# EAGLE design Grove - 3-axis analog accelerometer (EAGLE 6.1)
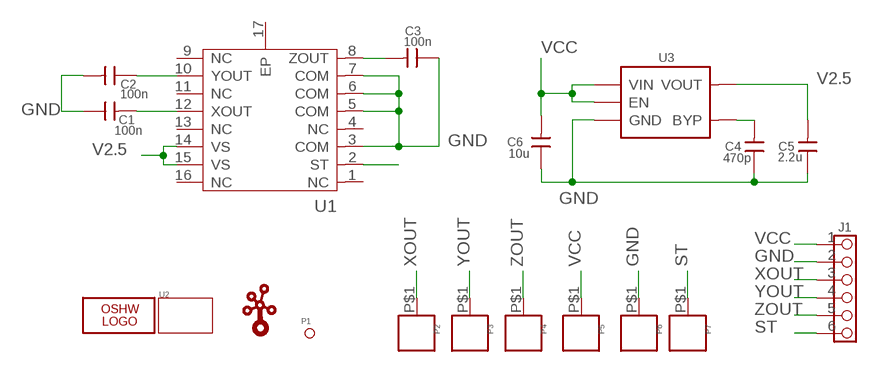
[diagram p0: schematic, sheet 1]

## Parts
C1  100n  C-0402  [0402]
C2  100n  C-0402  [0402]
C3  100n  C-0402  [0402]
C4  470p  C-0603  [0603]
C5  2.2u  C-0603  [0603]
C6  10u  C-0603  [0603]
J1  HEADER-6P-60/35MIL  [6P-2.54-60/35MIL]
LOGO2  LOGO-OSHW-6MILX0200-NT  [OSHW_6X200_NOTEXT]
P1  PAD-MARK  [ROUND-MARK-0.635]
P2  PAD'1X2MM'  [1P-1X2]
P3  PAD'1X2MM'  [1P-1X2]
P4  PAD'1X2MM'  [1P-1X2]
P5  PAD'1X2MM'  [1P-1X2]
P6  PAD'1X2MM'  [1P-1X2]
P7  PAD'1X2MM'  [1P-1X2]
U1  ADXL335  [LFCSP16-4X4]
U2  TWIG-1U  [1U-DIM-W/-DRILL]
U3  MIC5205  [SOT23-5]
U$1  LOGO-TWIGTWIGLOGO_SMALL  [TWIGLOGO_SMALL]

## Nets
GND: C1.1 C2.2 C3.1 C4.1 C5.1 C6.1 J1.2 P6.P$1 U1.3(COM) U1.5(COM) U1.6(COM) U1.7(COM) U3.2(GND)
N$7: C4.2 U3.4(BYP)
ST: J1.6 P7.P$1 U1.2(ST)
V2.5: C5.2 U1.14(VS) U1.15(VS) U3.5(VOUT)
VCC: C6.2 J1.1 P5.P$1 U3.1(VIN) U3.3(EN)
XOUT: C1.2 J1.3 P2.P$1 U1.12(XOUT)
YOUT: C2.1 J1.4 P3.P$1 U1.10(YOUT)
ZOUT: C3.2 J1.5 P4.P$1 U1.8(ZOUT)
Unconnected: U1.1(NC) U1.4(NC) U1.9(NC) U1.11(NC) U1.13(NC) U1.16(NC) U1.17(EP)

## Library data of the parts
C1-C6 = Discrete:C*: Ceramic Capacitors
J1 = Connector:HEADER-6P
LOGO2 = Logo:LOGO-OSHW-6MIL
P1 = Discrete:PAD-MARK
P2-P7 = Discrete:PAD
U1 = IC:ADXL335: Small,Low Power,3-Axis+/-3g Accelerometer
U2 = Module:TWIG
U3 = IC:MIC5205: The MIC5205 is an efficient linear voltage regulator with ultra-low-noise output, very low dropout voltage (typically 17mV at light loads and 165mV at 150mA), and very low ground current (600µA at 100mA output). The MIC5205 offers better than 1% initial accuracy. datasheet here: http://www.micrel.com/product-info/prod/5205.shtml
U$1 = Logo:LOGO-TWIG

## Board
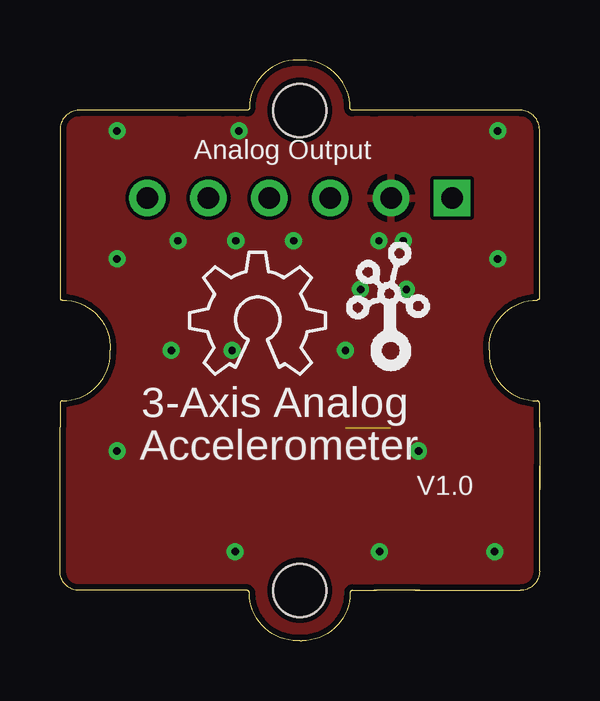
[diagram p1: board, top side]
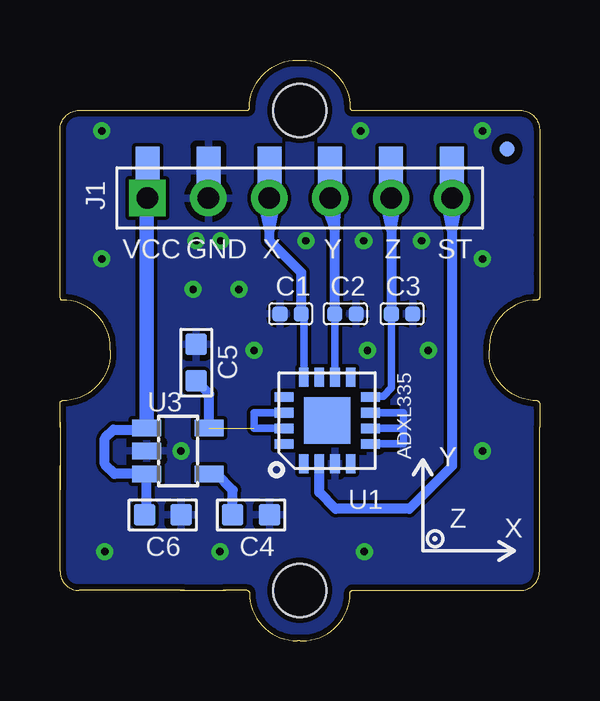
[diagram p2: board, bottom side, seen from below]

Size 20 x 24.2 mm. Coordinates in mm from the lower left corner, seen from the top.
Copper layers (1*16): Top 0.035mm / dielectric 1.5mm / Bottom 0.035mm
Design rules: minimum track width 6mil, minimum drill 12mil, track to track 6mil, track to pad 6mil, pad to pad 6mil, via to via 6mil, smd to smd 6mil, copper to edge 10mil, drill to drill 8mil, minimum pad ring 10mil, minimum via ring 8mil, stop-mask expansion 4mil, vias tented up to drill 25mil, thermal gap 10mil
bRestrict: area 5.8,7.9 to 7.5,9.8

### Footprints (pad centres in the part's own frame; a part is rotated, then mirrored left to right if it is on the bottom)
0402 = smd 0.635 x 0.635: 1 -0.445,0; 2 0.445,0
0603 = smd 0.889 x 0.889: 1 -0.762,0; 2 0.762,0
6P-2.54-60/35MIL = drill 0.889 pad 1.524 square: 1 0,6.35 | drill 0.889 pad 1.524: 2 0,3.81; 3 0,1.27; 4 0,-1.27; 5 0,-3.81; 6 0,-6.35
ROUND-MARK-0.635 = smd 0.635 x 0.635: P$1 0,0
1P-1X2 = smd 2 x 1: P$1 0,0
LFCSP16-4X4 = smd 0.8 x 0.4: 1 -1.8,0.975; 2 -1.8,0.325; 3 -1.8,-0.325; 4 -1.8,-0.975; 9 1.8,-0.975; 10 1.8,-0.325; 11 1.8,0.325; 12 1.8,0.975 | smd 0.4 x 0.8: 5 -0.975,-1.8; 6 -0.325,-1.8; 7 0.325,-1.8; 8 0.975,-1.8; 13 0.975,1.8; 14 0.325,1.8; 15 -0.325,1.8; 16 -0.975,1.8 | smd 1.95 x 1.95: 17 0,0
1U-DIM-W/-DRILL = hole 2.2: 0,-10; 0,10
SOT23-5 = smd 0.69 x 1.2: 1 -0.95,-1.3; 2 0,-1.3; 3 0.95,-1.3; 4 0.95,1.3; 5 -0.95,1.3

### Placement (x,y rotation side)
C1  10.38,13.62 0 bottom
C2  8.1,13.62 0 bottom
C3  5.73,13.62 180 bottom
C4  12.03,5.24 180 bottom
C5  14.32,11.59 270 bottom
C6  15.71,5.24 180 bottom
J1  10,18.45 90 bottom
LOGO2  5.4,11.11 0 top
P1  1.36,20.48 0 bottom
P2  11.27,19.59 90 bottom
P3  8.73,19.59 90 bottom
P4  6.19,19.59 90 bottom
P5  16.35,19.59 90 bottom
P6  13.81,19.59 90 bottom
P7  3.65,19.59 90 bottom
U1  8.86,9.18 90 bottom
U2  10,12.1 0 bottom
U3  15.08,7.91 270 bottom
U$1  11.55,11.11 0 top

### Tracks (layer width: path | path; a pad name or v marks a point on that pad's centre or on a via)
GND  (via drill 0.3)
  Bottom 0.305: U1.7 5.68,9.5 5.68,8.85 | U1.5 7.06,8.21 5.68,8.21 5.68,8.85 | U1.6 5.68,8.85
  other vias: 18.26,15.91 14.45,14.64 12.54,14.64 11.9,12.1 2.38,15.91 2.38,7.91 7.31,3.72 13.33,3.72 18.13,3.72 14.95,7.91 7.46,21.24 2.38,21.24 18.26,21.24 7.18,12.1 4.64,12.1 14.32,16.67 13.3,16.67 9.75,16.67 7.33,16.67 4.92,16.67
  pour Top: 23.21,25.56 23.21,-1.87 -2.7,-1.87 -2.7,25.56
  pour Bottom: 23.21,25.56 23.21,-1.87 -2.7,-1.87 -2.7,25.56
N$7
  Bottom 0.406: C4.2 12.79,6.28 13.47,6.96 U3.4
ST
  Bottom 0.406: J1.6 3.65,17.12 | U1.2 9.19,6.18 8.5,5.5 5.43,5.5 3.65,7.27 3.65,17.12 | 3.65,17.12 | 3.92,18.39 | 3.65,17.12 3.38,18.39 | 3.65,17.12 3.92,18.39 | 3.92,18.39 | J1.6 3.92,18.39 | 3.38,18.39 3.65,17.12 | 3.38,18.39 | 3.92,18.39 3.65,17.12 | 3.92,18.39 J1.6 | 3.38,18.39 3.65,17.12 | 3.65,17.12 | 3.92,18.39 3.65,17.12 | 3.38,18.39 3.65,17.12 | J1.6 3.38,18.39 | 3.92,18.39 3.65,17.12 | J1.6 3.92,18.39 | 3.38,18.39 3.65,17.12 | J1.6 3.38,18.39 | 3.92,18.39 3.65,17.12 | J1.6 3.92,18.39 | P7.P$1 J1.6
V2.5  (1 unrouted)
  Bottom 0.305: U1.15 11.9,8.86 11.9,9.5 U1.14
  Bottom 0.406: C5.2 13.78,10.29 U3.5
VCC
  Bottom 0.406: 16.38,18.42 J1.1 P5.P$1 | U3.1 16.44,8.8 17.77,8.8 18.13,8.44 18.13,7.36 17.72,6.96 U3.3 16.38,5.08 C6.2
  Bottom 0.61: U3.1 16.38,18.42
XOUT
  Bottom 0.305: U1.12 9.83,13.52 C1.2
  Bottom 0.406: C1.2 9.94,15.34 11.27,16.67 11.27,17.12 | 11.27,17.12 J1.3 | 11,18.39 | 11.27,17.12 | 11.27,17.12 11,18.39 | 11,18.39 | J1.3 11,18.39 | 11.27,17.12 11.54,18.39 | 11.54,18.39 | 11.27,17.12 11,18.39 | 11.27,17.12 11.54,18.39 | 11,18.39 11.27,17.12 | 11,18.39 J1.3 | 11.27,17.12 | 11.54,18.39 11.27,17.12 | 11.54,18.39 J1.3 | 11.27,17.12 11,18.39 | J1.3 11,18.39 | 11.54,18.39 11.27,17.12 | 11.54,18.39 J1.3 | J1.3 P2.P$1
YOUT
  Bottom 0.305: U1.10 C2.1
  Bottom 0.406: C2.1 8.53,17.13 | 8.53,17.13 8.53,18.25 J1.4 | 8.53,17.13 8.45,18.43 J1.4 | 8.53,17.13 8.99,18.35 J1.4 | J1.4 P3.P$1
ZOUT
  Bottom 0.305: C3.2 6.18,10.54 6.52,10.2 7.02,10.2 U1.8
  Bottom 0.406: 6.19,17.12 C3.2 | 6.19,17.12 J1.5 | 6.19,17.12 5.92,18.39 J1.5 | 6.19,17.12 6.46,18.39 J1.5 | J1.5 P4.P$1

### Text on the board
tNames: Analog Output | 3-Axis Analog | Accelerometer | V1.0
bNames: ST | Z | Y | X | GND | VCC | ADXL335 | Y | Z | X